# EAGLE schematic voltmeter-hack (EAGLE 6.3)
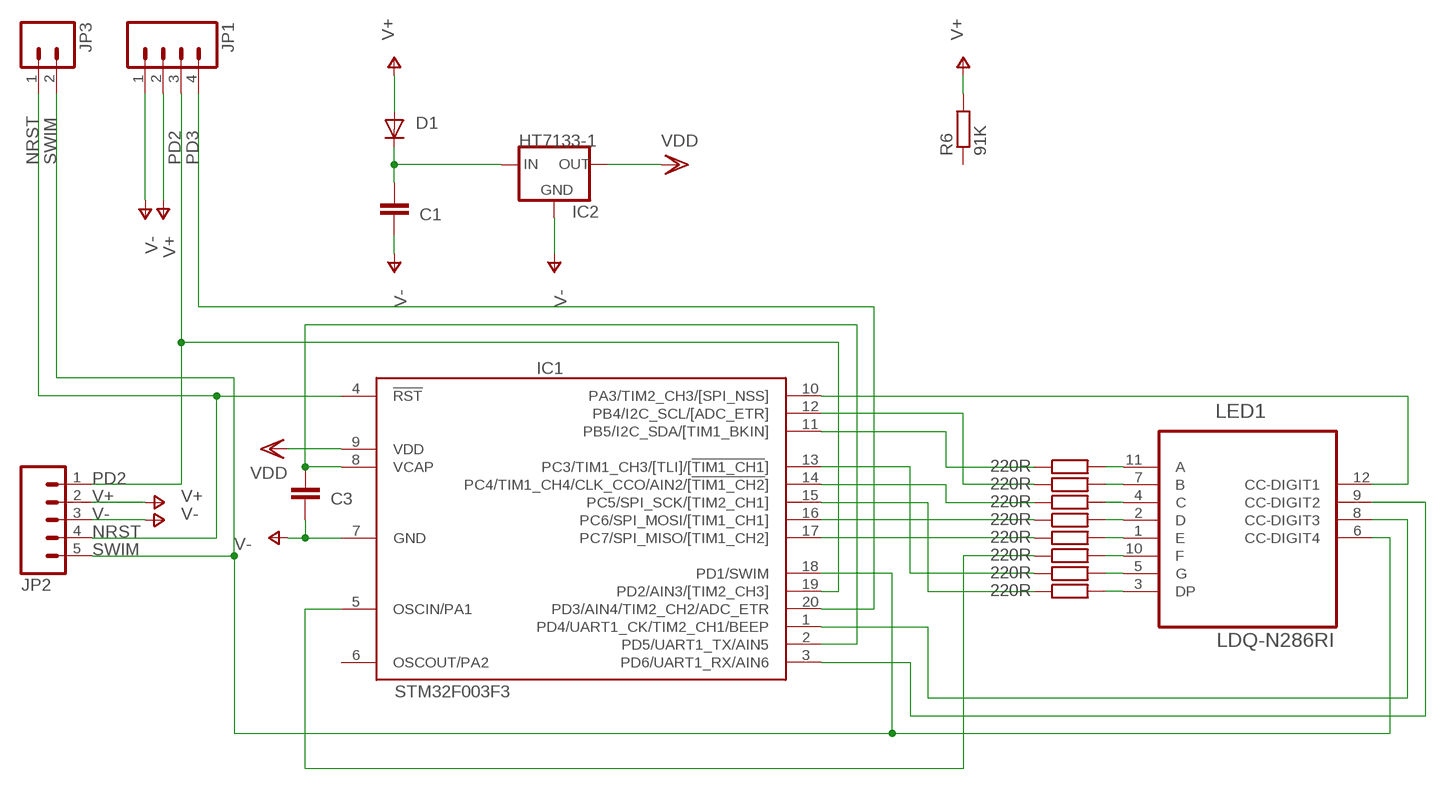
[diagram p0: schematic, sheet 1]

## Parts
C1  C-EUC0603  [C0603]
C3  C-EUC0603  [C0603]
D1  DIODE-SOD-123  [SOD-123]
IC1  STM32F003F3  [TSSOP20]
IC2  HT7133-1  XC63FPP  [SOT89R]
JP1  M04PTH  [1X04]
JP2  M05PTH  [1X05]
JP3  M02PTH  [1X02]
LED1  LDQ-N286RI  [LUMEX_LDQ-N286RI]
R1  220R  R-EU_R0603  [R0603]
R2  220R  R-EU_R0603  [R0603]
R4  220R  R-EU_R0603  [R0603]
R5  220R  R-EU_R0603  [R0603]
R6  91K  R-EU_R0603  [R0603]
R7  220R  R-EU_R0603  [R0603]
R8  220R  R-EU_R0603  [R0603]
R13  220R  R-EU_R0603  [R0603]
R16  220R  R-EU_R0603  [R0603]

## Nets
N$1: C1.2 D1.C IC2.2(IN)
N$4: C3.2 IC1.2(PD5/UART1_TX/AIN5) IC1.8(VCAP)
N$5: IC1.10(PA3/TIM2_CH3/[SPI_NSS]) LED1.12(CC-DIGIT1)
N$6: IC1.1(PD4/UART1_CK/TIM2_CH1/BEEP) LED1.8(CC-DIGIT3)
N$7: IC1.3(PD6/UART1_RX/AIN6) LED1.9(CC-DIGIT2)
N$8: LED1.11(A) R1.2
N$9: LED1.7(B) R2.2
N$10: LED1.4(C) R13.2
N$11: LED1.2(D) R4.2
N$12: LED1.1(E) R5.2
N$13: LED1.10(F) R16.2
N$14: LED1.5(G) R7.2
N$15: LED1.3(DP) R8.2
N$16: IC1.17(PC7/SPI_MISO/[TIM1_CH2]) R5.1
N$17: IC1.16(PC6/SPI_MOSI/[TIM1_CH1]) R4.1
N$18: IC1.15(PC5/SPI_SCK/[TIM2_CH1]) R8.1
N$19: IC1.14(PC4/TIM1_CH4/CLK_CCO/AIN2/[!TIM1_CH2!]) R13.1
N$20: IC1.13(PC3/TIM1_CH3/[TLI]/[!TIM1_CH1!]) R7.1
N$21: IC1.12(PB4/I2C_SCL/[ADC_ETR]) R2.1
N$22: IC1.11(PB5/I2C_SDA/[TIM1_BKIN]) R1.1
N$23: IC1.5(OSCIN/PA1) R16.1
NRST: IC1.4(!RST) JP2.4 JP3.1
PD2: IC1.19(PD2/AIN3/[TIM2_CH3]) JP1.3 JP2.1
PD3: IC1.20(PD3/AIN4/TIM2_CH2/ADC_ETR) JP1.4
SWIM: IC1.18(PD1/SWIM) JP2.5 JP3.2 LED1.6(CC-DIGIT4)
V+: D1.A JP1.2 JP2.2 R6.2
V-: C1.1 C3.1 IC1.7(GND) IC2.1(GND) JP1.1 JP2.3
VDD: IC1.9(VDD) IC2.3(OUT)
Unconnected: IC1.6(OSCOUT/PA2) R6.1

## Library data of the parts
C1 C3 = resistor:C-EU: CAPACITOR, European symbol
D1 = dp_devices:DIODE: Various Diode Packages
IC1 = stm8:STM32F003: Value line, 16 MHz STM8S 8-bit MCU, 8 Kbytes Flash, 128 bytes data EEPROM, 10-bit ADC, 3 timers, UART, SPI, I2C
IC2 = v-reg:XC63FP: Positiv Voltage Regulators www.torex.co.jp/english/product/pro02/pdf/0201_xc62fp.pdf
JP1 = SparkFun:M04: Header 4 Standard 4-pin 0.1" header. Use with straight break away headers (SKU : PRT-00116), right angle break away headers (PRT-00553), swiss pins (PRT-00743), machine pins (PRT-00117), and female headers (PRT-00115). Molex polarized connector foot print use with SKU : PRT-08231 with associated crimp pins and housings. 1MM SMD Version SKU: PRT-10208
JP2 = SparkFun:M05: Header 5 Standard 5-pin 0.1" header. Use with straight break away headers (SKU : PRT-00116), right angle break away headers (PRT-00553), swiss pins (PRT-00743), machine pins (PRT-00117), and female headers (PRT-00115). Molex polarized connector foot print use with SKU : PRT-08230 with associated crimp pins and housings.
JP3 = SparkFun:M02: Header 2 Standard 2-pin 0.1" header. Use with straight break away headers (SKU : PRT-00116), right angle break away headers (PRT-00553), swiss pins (PRT-00743), machine pins (PRT-00117), and female headers (PRT-00115). Molex polarized connector foot print use with SKU : PRT-08233 with associated crimp pins and housings.
LED1 = LDQ-N286RI:LDQ-N286RI: 0.28" 4 digit , SEVEN SEGMENT Display, RED, Gray Face with milkey white diffused segments; MPN: LDQ-N286RI; OC_FARNELL: 1795532; OC_NEWARK: 19J8030; PACKAGE: DIP -TH; SUPPLIER: LUMEX
R1 R2 R4-R8 R13 R16 = resistor:R-EU_: RESISTOR, European symbol